# Altium schematic sheet PRINCIPAL.SchDoc: SOE - Sistema heterodino
size A4; Author: Mario de Miguel; Revision: 1; SheetNumber: 1; SheetTotal: 3; ProjectTitle: SWSH-Cross
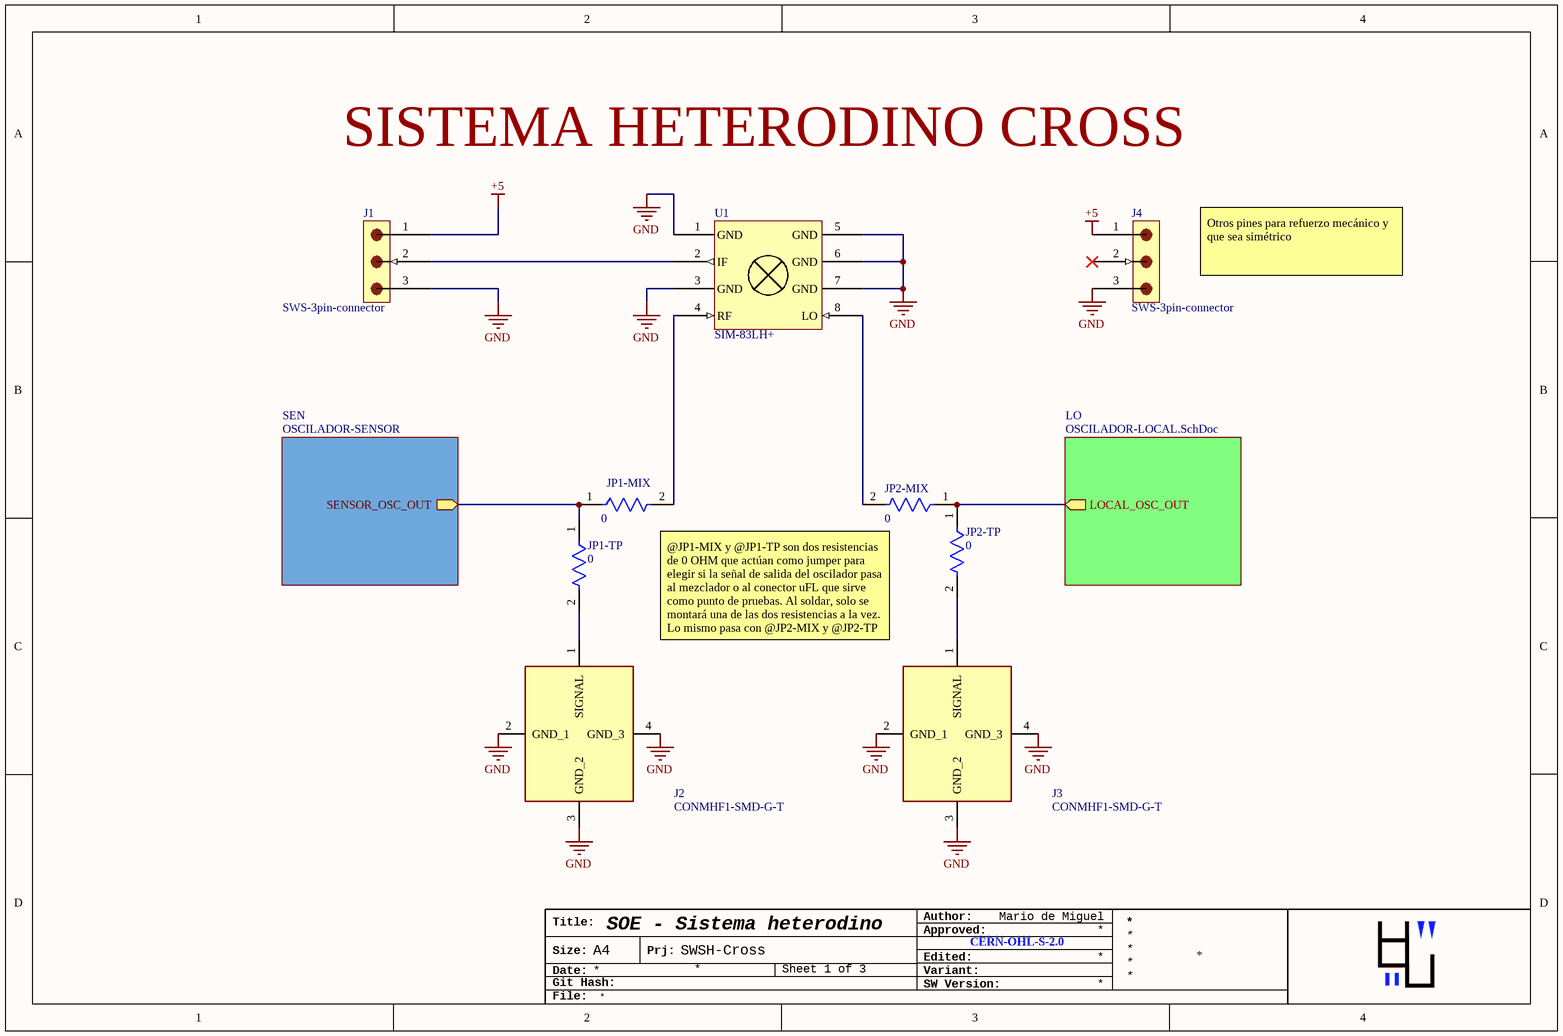
[diagram p0: PRINCIPAL.SchDoc]

## Parts
J1  SWS-3pin-connector  [CASTELLATED-SWS-3PIN-CONN]
J2  CONMHF1-SMD-G-T  [CONMHF1SMDGT]
J3  CONMHF1-SMD-G-T  [CONMHF1SMDGT]
J4  SWS-3pin-connector  [CASTELLATED-SWS-3PIN-CONN]
JP1-MIX  0  [FP-CRCW0603-C-MFG]
JP1-TP  0  [FP-CRCW0603-C-MFG]
JP2-MIX  0  [FP-CRCW0603-C-MFG]
JP2-TP  0  [FP-CRCW0603-C-MFG]
U1  SIM-83LH+  [HV1195-SIM-83LH+]

## Sub-sheets
LO = OSCILADOR-LOCAL.SchDoc: LOCAL_OSC_OUT (out)
SEN = OSCILADOR-SENSOR: SENSOR_OSC_OUT (out)

## Nets
+5: J1.1(5V) J4.1(5V)
GND: J1.3(GND) J2.2(GND_1) J2.3(GND_2) J2.4(GND_3) J3.2(GND_1) J3.3(GND_2) J3.4(GND_3) J4.3(GND) U1.1(GND) U1.3(GND) U1.5(GND) U1.6(GND) U1.7(GND)
NetJ1_2: J1.2(OUT) U1.2(IF)
NetJ2_1: J2.1(SIGNAL) JP1-TP.2
NetJ3_1: J3.1(SIGNAL) JP2-TP.2
NetJP1-MIX_1: JP1-MIX.1 JP1-TP.1 ; sheet SEN/SENSOR_OSC_OUT
NetJP1-MIX_2: JP1-MIX.2 U1.4(RF)
NetJP2-MIX_1: JP2-MIX.1 JP2-TP.1 ; sheet LO/LOCAL_OSC_OUT
NetJP2-MIX_2: JP2-MIX.2 U1.8(LO)

Not connected (* = marked no-connect by the designer): J4 2(OUT)*

## Notes on the sheet
- SISTEMA HETERODINO CROSS
- Otros pines para refuerzo mecánico y que sea simétrico
- @JP1-MIX y @JP1-TP son dos resistencias de 0 OHM que actúan como jumper para elegir si la señal de salida del oscilador pasa al mezclador o al conector uFL que sirve como punto de pruebas. Al soldar, solo se montará una de las dos resistencias a la vez. Lo mismo pasa con @JP2-MIX y @JP2-TP
- Title:
- Author:
- Approved:
- Size:
- Date:
- Git Hash:
- A4
- Prj:
- SW Version:
- Variant:
- Edited:
- CERN-OHL-S-2.0
- File:

## Library data of the parts
J2 J3 = CONMHF1-SMD-G-T: Integrated Circuit; Manufacturer_Name: TE Connectivity; Datasheet Link: https://www.te.com/commerce/DocumentDelivery/DDEController?Action=srchrtrv&DocNm=conmhf1-smd-g-t-ds&DocType=Data%20Sheet&DocLang=English&PartCntxt=CONMHF1-SMD-G-T&DocFormat=pdf; Height: 1.31mm; Manufacturer_Part_Number: CONMHF1-SMD-G-T; Mouser Part Number: 712-CONMHF1-SMD-G-T; Mouser Price/Stock: https://www.mouser.co.uk/ProductDetail/TE-Connectivity-Linx-Technologies/CONMHF1-SMD-G-T?qs=7D1LtPJG0i0JqNJVGTgWfg%3D%3D; Arrow Part Number: CONMHF1-SMD-G-T; Arrow Price/Stock: https://www.arrow.com/en/products/conmhf1-smd-g-t/te-connectivity?utm_currency=USD&region=europe
JP1-MIX JP1-TP JP2-MIX JP2-TP = CMP-02407-011552-1: RES 0 OHM JUMPER 1/10W 0603; Max Power Dissipation: 100mW; Resistance: 0mR; Min Operating Temperature: -55°C; Packaging: Cut Tape; Resistor Type: Thick Film; RoHS Compliant: Yes; Case/Package: 0603; Case Code (Imperial): 0603; Max Operating Temperature: 155°C; Number of Terminations: 2; Case Code (Metric): 1608
U1 = SIM-83LH+: RF Mixer 1700 - 8000 MHz